# EAGLE design teensyShield1.5 (EAGLE 7.5.0)
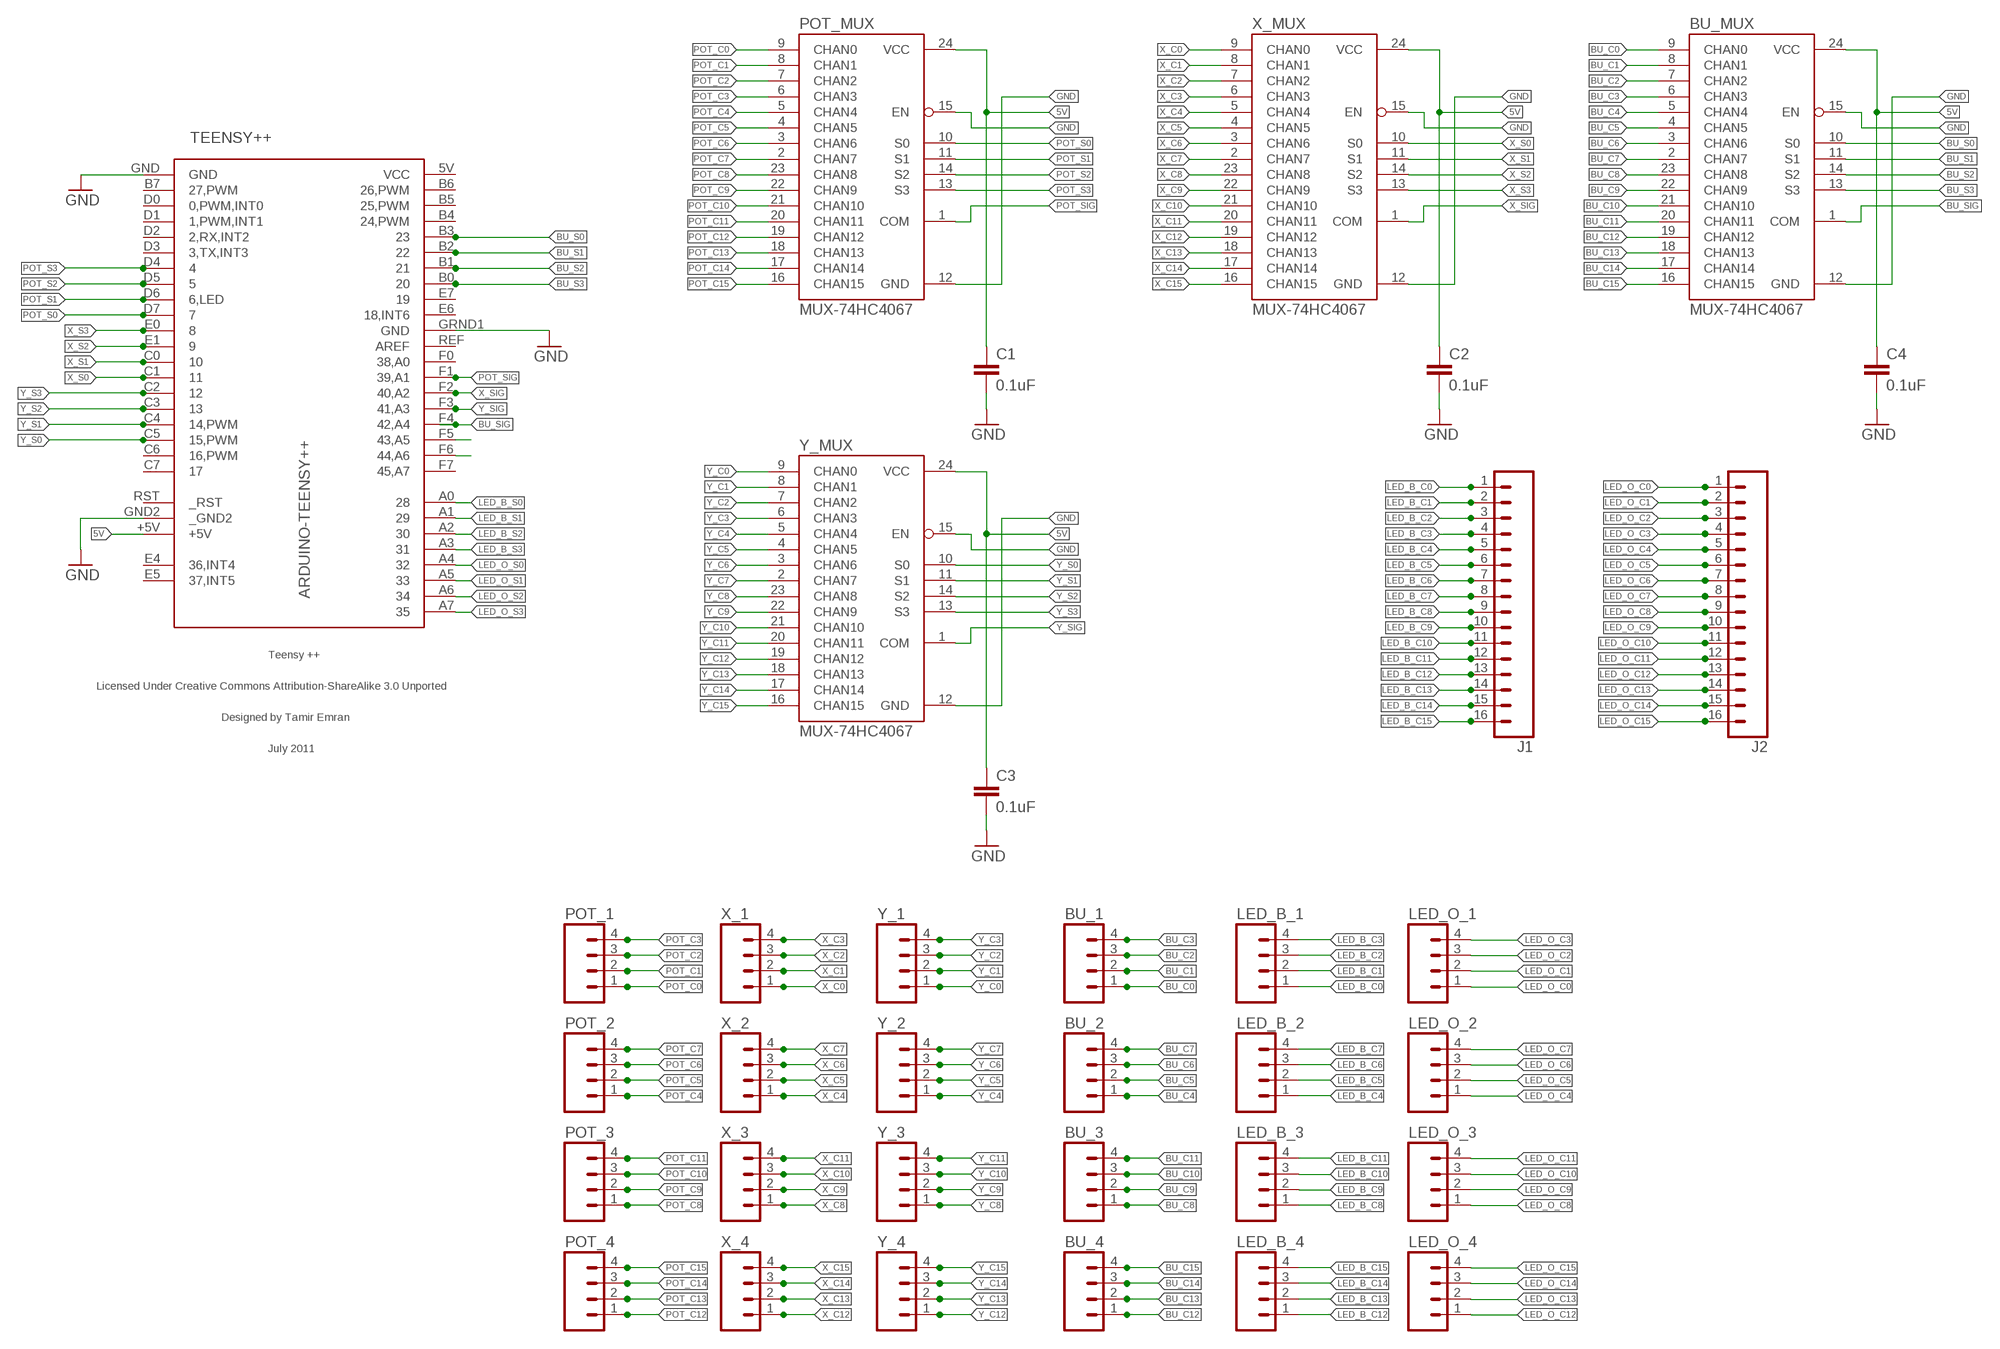
[diagram p0: schematic, sheet 1]

## Parts
BU_1  M04NO_SILK_ALL_ROUND  [1X04_NO_SILK_ALL_ROUND]
BU_2  M04NO_SILK_ALL_ROUND  [1X04_NO_SILK_ALL_ROUND]
BU_3  M04NO_SILK_ALL_ROUND  [1X04_NO_SILK_ALL_ROUND]
BU_4  M04NO_SILK_ALL_ROUND  [1X04_NO_SILK_ALL_ROUND]
BU_MUX  MUX-74HC4067  MUX-74HC4067SMD  [SSOP24]
C1  0.1uF  CAP0603  [0603]
C2  0.1uF  CAP0603  [0603]
C3  0.1uF  CAP0603  [0603]
C4  0.1uF  CAP0603  [0603]
J1  M16MACHIINE-PIN_LOCK  [1X16_MACHINE-PIN-HEADER_LOCK.004]
J2  M16MACHIINE-PIN_LOCK  [1X16_MACHINE-PIN-HEADER_LOCK.004]
LED_B_1  M04NO_SILK_ALL_ROUND  [1X04_NO_SILK_ALL_ROUND]
LED_B_2  M04NO_SILK_ALL_ROUND  [1X04_NO_SILK_ALL_ROUND]
LED_B_3  M04NO_SILK_ALL_ROUND  [1X04_NO_SILK_ALL_ROUND]
LED_B_4  M04NO_SILK_ALL_ROUND  [1X04_NO_SILK_ALL_ROUND]
LED_O_1  M04NO_SILK_ALL_ROUND  [1X04_NO_SILK_ALL_ROUND]
LED_O_2  M04NO_SILK_ALL_ROUND  [1X04_NO_SILK_ALL_ROUND]
LED_O_3  M04NO_SILK_ALL_ROUND  [1X04_NO_SILK_ALL_ROUND]
LED_O_4  M04NO_SILK_ALL_ROUND  [1X04_NO_SILK_ALL_ROUND]
POT_1  M04NO_SILK_ALL_ROUND  [1X04_NO_SILK_ALL_ROUND]
POT_2  M04NO_SILK_ALL_ROUND  [1X04_NO_SILK_ALL_ROUND]
POT_3  M04NO_SILK_ALL_ROUND  [1X04_NO_SILK_ALL_ROUND]
POT_4  M04NO_SILK_ALL_ROUND  [1X04_NO_SILK_ALL_ROUND]
POT_MUX  MUX-74HC4067  MUX-74HC4067SMD  [SSOP24]
TEENSY++  ARDUINO-TEENSY++  [TEENSY++]
X_1  M04NO_SILK_ALL_ROUND  [1X04_NO_SILK_ALL_ROUND]
X_2  M04NO_SILK_ALL_ROUND  [1X04_NO_SILK_ALL_ROUND]
X_3  M04NO_SILK_ALL_ROUND  [1X04_NO_SILK_ALL_ROUND]
X_4  M04NO_SILK_ALL_ROUND  [1X04_NO_SILK_ALL_ROUND]
X_MUX  MUX-74HC4067  MUX-74HC4067SMD  [SSOP24]
Y_1  M04NO_SILK_ALL_ROUND  [1X04_NO_SILK_ALL_ROUND]
Y_2  M04NO_SILK_ALL_ROUND  [1X04_NO_SILK_ALL_ROUND]
Y_3  M04NO_SILK_ALL_ROUND  [1X04_NO_SILK_ALL_ROUND]
Y_4  M04NO_SILK_ALL_ROUND  [1X04_NO_SILK_ALL_ROUND]
Y_MUX  MUX-74HC4067  MUX-74HC4067SMD  [SSOP24]

## Nets
5V: BU_MUX.24(VCC) C1.1 C2.1 C3.1 C4.1 POT_MUX.24(VCC) X_MUX.24(VCC) Y_MUX.24(VCC)
BU_C0: BU_1.1 BU_MUX.9(CHAN0)
BU_C1: BU_1.2 BU_MUX.8(CHAN1)
BU_C2: BU_1.3 BU_MUX.7(CHAN2)
BU_C3: BU_1.4 BU_MUX.6(CHAN3)
BU_C4: BU_2.1 BU_MUX.5(CHAN4)
BU_C5: BU_2.2 BU_MUX.4(CHAN5)
BU_C6: BU_2.3 BU_MUX.3(CHAN6)
BU_C7: BU_2.4 BU_MUX.2(CHAN7)
BU_C8: BU_3.1 BU_MUX.23(CHAN8)
BU_C9: BU_3.2 BU_MUX.22(CHAN9)
BU_C10: BU_3.3 BU_MUX.21(CHAN10)
BU_C11: BU_3.4 BU_MUX.20(CHAN11)
BU_C12: BU_4.1 BU_MUX.19(CHAN12)
BU_C13: BU_4.2 BU_MUX.18(CHAN13)
BU_C14: BU_4.3 BU_MUX.17(CHAN14)
BU_C15: BU_4.4 BU_MUX.16(CHAN15)
BU_S0: BU_MUX.10(S0) TEENSY++.B3
BU_S1: BU_MUX.11(S1) TEENSY++.B2
BU_S2: BU_MUX.14(S2) TEENSY++.B1
BU_S3: BU_MUX.13(S3) TEENSY++.B0
BU_SIG: BU_MUX.1(COM) TEENSY++.F4(42,A4)
GND: BU_MUX.12(GND) BU_MUX.15(EN) C1.2 C2.2 C3.2 C4.2 POT_MUX.12(GND) POT_MUX.15(EN) TEENSY++.GND TEENSY++.GND2(_GND2) TEENSY++.GRND1(GND) X_MUX.12(GND) X_MUX.15(EN) Y_MUX.12(GND) Y_MUX.15(EN)
LED_B_C0: J1.1 LED_B_1.1
LED_B_C1: J1.2 LED_B_1.2
LED_B_C2: J1.3 LED_B_1.3
LED_B_C3: J1.4 LED_B_1.4
LED_B_C4: J1.5 LED_B_2.1
LED_B_C5: J1.6 LED_B_2.2
LED_B_C6: J1.7 LED_B_2.3
LED_B_C7: J1.8 LED_B_2.4
LED_B_C8: J1.9 LED_B_3.1
LED_B_C9: J1.10 LED_B_3.2
LED_B_C10: J1.11 LED_B_3.3
LED_B_C11: J1.12 LED_B_3.4
LED_B_C12: J1.13 LED_B_4.1
LED_B_C13: J1.14 LED_B_4.2
LED_B_C14: J1.15 LED_B_4.3
LED_B_C15: J1.16 LED_B_4.4
LED_B_S0: TEENSY++.A0
LED_B_S1: TEENSY++.A1
LED_B_S2: TEENSY++.A2
LED_B_S3: TEENSY++.A3
LED_O_C0: J2.1 LED_O_1.1
LED_O_C1: J2.2 LED_O_1.2
LED_O_C2: J2.3 LED_O_1.3
LED_O_C3: J2.4 LED_O_1.4
LED_O_C4: J2.5 LED_O_2.1
LED_O_C5: J2.6 LED_O_2.2
LED_O_C6: J2.7 LED_O_2.3
LED_O_C7: J2.8 LED_O_2.4
LED_O_C8: J2.9 LED_O_3.1
LED_O_C9: J2.10 LED_O_3.2
LED_O_C10: J2.11 LED_O_3.3
LED_O_C11: J2.12 LED_O_3.4
LED_O_C12: J2.13 LED_O_4.1
LED_O_C13: J2.14 LED_O_4.2
LED_O_C14: J2.15 LED_O_4.3
LED_O_C15: J2.16 LED_O_4.4
LED_O_S0: TEENSY++.A4
LED_O_S1: TEENSY++.A5
LED_O_S2: TEENSY++.A6
LED_O_S3: TEENSY++.A7
N$1: TEENSY++.F2(40,A2)
N$2: TEENSY++.F1(39,A1)
N$3: TEENSY++.F5(43,A5)
N$4: TEENSY++.+5V
N$5: TEENSY++.F6(44,A6)
POT_C0: POT_1.1 POT_MUX.9(CHAN0)
POT_C1: POT_1.2 POT_MUX.8(CHAN1)
POT_C2: POT_1.3 POT_MUX.7(CHAN2)
POT_C3: POT_1.4 POT_MUX.6(CHAN3)
POT_C4: POT_2.1 POT_MUX.5(CHAN4)
POT_C5: POT_2.2 POT_MUX.4(CHAN5)
POT_C6: POT_2.3 POT_MUX.3(CHAN6)
POT_C7: POT_2.4 POT_MUX.2(CHAN7)
POT_C8: POT_3.1 POT_MUX.23(CHAN8)
POT_C9: POT_3.2 POT_MUX.22(CHAN9)
POT_C10: POT_3.3 POT_MUX.21(CHAN10)
POT_C11: POT_3.4 POT_MUX.20(CHAN11)
POT_C12: POT_4.1 POT_MUX.19(CHAN12)
POT_C13: POT_4.2 POT_MUX.18(CHAN13)
POT_C14: POT_4.3 POT_MUX.17(CHAN14)
POT_C15: POT_4.4 POT_MUX.16(CHAN15)
POT_S0: POT_MUX.10(S0) TEENSY++.D7
POT_S1: POT_MUX.11(S1) TEENSY++.D6(6,LED)
POT_S2: POT_MUX.14(S2) TEENSY++.D5
POT_S3: POT_MUX.13(S3) TEENSY++.D4
POT_SIG: POT_MUX.1(COM)
X_C0: X_1.1 X_MUX.9(CHAN0)
X_C1: X_1.2 X_MUX.8(CHAN1)
X_C2: X_1.3 X_MUX.7(CHAN2)
X_C3: X_1.4 X_MUX.6(CHAN3)
X_C4: X_2.1 X_MUX.5(CHAN4)
X_C5: X_2.2 X_MUX.4(CHAN5)
X_C6: X_2.3 X_MUX.3(CHAN6)
X_C7: X_2.4 X_MUX.2(CHAN7)
X_C8: X_3.1 X_MUX.23(CHAN8)
X_C9: X_3.2 X_MUX.22(CHAN9)
X_C10: X_3.3 X_MUX.21(CHAN10)
X_C11: X_3.4 X_MUX.20(CHAN11)
X_C12: X_4.1 X_MUX.19(CHAN12)
X_C13: X_4.2 X_MUX.18(CHAN13)
X_C14: X_4.3 X_MUX.17(CHAN14)
X_C15: X_4.4 X_MUX.16(CHAN15)
X_S0: TEENSY++.C1 X_MUX.10(S0)
X_S1: TEENSY++.C0 X_MUX.11(S1)
X_S2: TEENSY++.E1 X_MUX.14(S2)
X_S3: TEENSY++.E0 X_MUX.13(S3)
X_SIG: X_MUX.1(COM)
Y_C0: Y_1.1 Y_MUX.9(CHAN0)
Y_C1: Y_1.2 Y_MUX.8(CHAN1)
Y_C2: Y_1.3 Y_MUX.7(CHAN2)
Y_C3: Y_1.4 Y_MUX.6(CHAN3)
Y_C4: Y_2.1 Y_MUX.5(CHAN4)
Y_C5: Y_2.2 Y_MUX.4(CHAN5)
Y_C6: Y_2.3 Y_MUX.3(CHAN6)
Y_C7: Y_2.4 Y_MUX.2(CHAN7)
Y_C8: Y_3.1 Y_MUX.23(CHAN8)
Y_C9: Y_3.2 Y_MUX.22(CHAN9)
Y_C10: Y_3.3 Y_MUX.21(CHAN10)
Y_C11: Y_3.4 Y_MUX.20(CHAN11)
Y_C12: Y_4.1 Y_MUX.19(CHAN12)
Y_C13: Y_4.2 Y_MUX.18(CHAN13)
Y_C14: Y_4.3 Y_MUX.17(CHAN14)
Y_C15: Y_4.4 Y_MUX.16(CHAN15)
Y_S0: TEENSY++.C5(15,PWM) Y_MUX.10(S0)
Y_S1: TEENSY++.C4(14,PWM) Y_MUX.11(S1)
Y_S2: TEENSY++.C3 Y_MUX.14(S2)
Y_S3: TEENSY++.C2 Y_MUX.13(S3)
Y_SIG: TEENSY++.F3(41,A3) Y_MUX.1(COM)
Unconnected: TEENSY++.B4(24,PWM) TEENSY++.B5(25,PWM) TEENSY++.B6(26,PWM) TEENSY++.B7(27,PWM) TEENSY++.C6(16,PWM) TEENSY++.C7 TEENSY++.D0(0,PWM,INT0) TEENSY++.D1(1,PWM,INT1) TEENSY++.D2(2,RX,INT2) TEENSY++.D3(3,TX,INT3) TEENSY++.E4(36,INT4) TEENSY++.E5(37,INT5) TEENSY++.E6(18,INT6) TEENSY++.E7 TEENSY++.F0(38,A0) TEENSY++.F7(45,A7) TEENSY++.REF(AREF) TEENSY++.RST(_RST)

## Power pins joined to a net without a drawn wire
VCC: TEENSY++.5V(VCC)

## Library data of the parts
BU_1-BU_4 LED_B_1-LED_B_4 LED_O_1-LED_O_4 POT_1-POT_4 X_1-X_4 Y_1-Y_4 = SparkFun-Connectors:M04: Header 4 Standard 4-pin 0.1" header. Use with straight break away headers (SKU : PRT-00116), right angle break away headers (PRT-00553), swiss pins (PRT-00743), machine pins (PRT-00117), and female headers (PRT-00115). Molex polarized connector foot print use with SKU : PRT-08231 with associated crimp pins and housings. 1MM SMD Version SKU: PRT-10208; PROD_ID: CONN-09696
BU_MUX POT_MUX X_MUX Y_MUX = SparkFun:MUX-74HC4067
C1-C4 = SparkFun:CAP: Capacitor Standard 0603 ceramic capacitor, and 0.1" leaded capacitor.
J1 J2 = SparkFun-Connectors:M16: 1x16 .1" header
TEENSY++ = teensypp:ARDUINO-TEENSY++: Teensy ++ Original Design by Mark Gross Modified Design by Tamir Emran Licensed Under Creative Commons Attribution-ShareAlike 3.0 Unported (CC BY-SA 3.0)

## Board
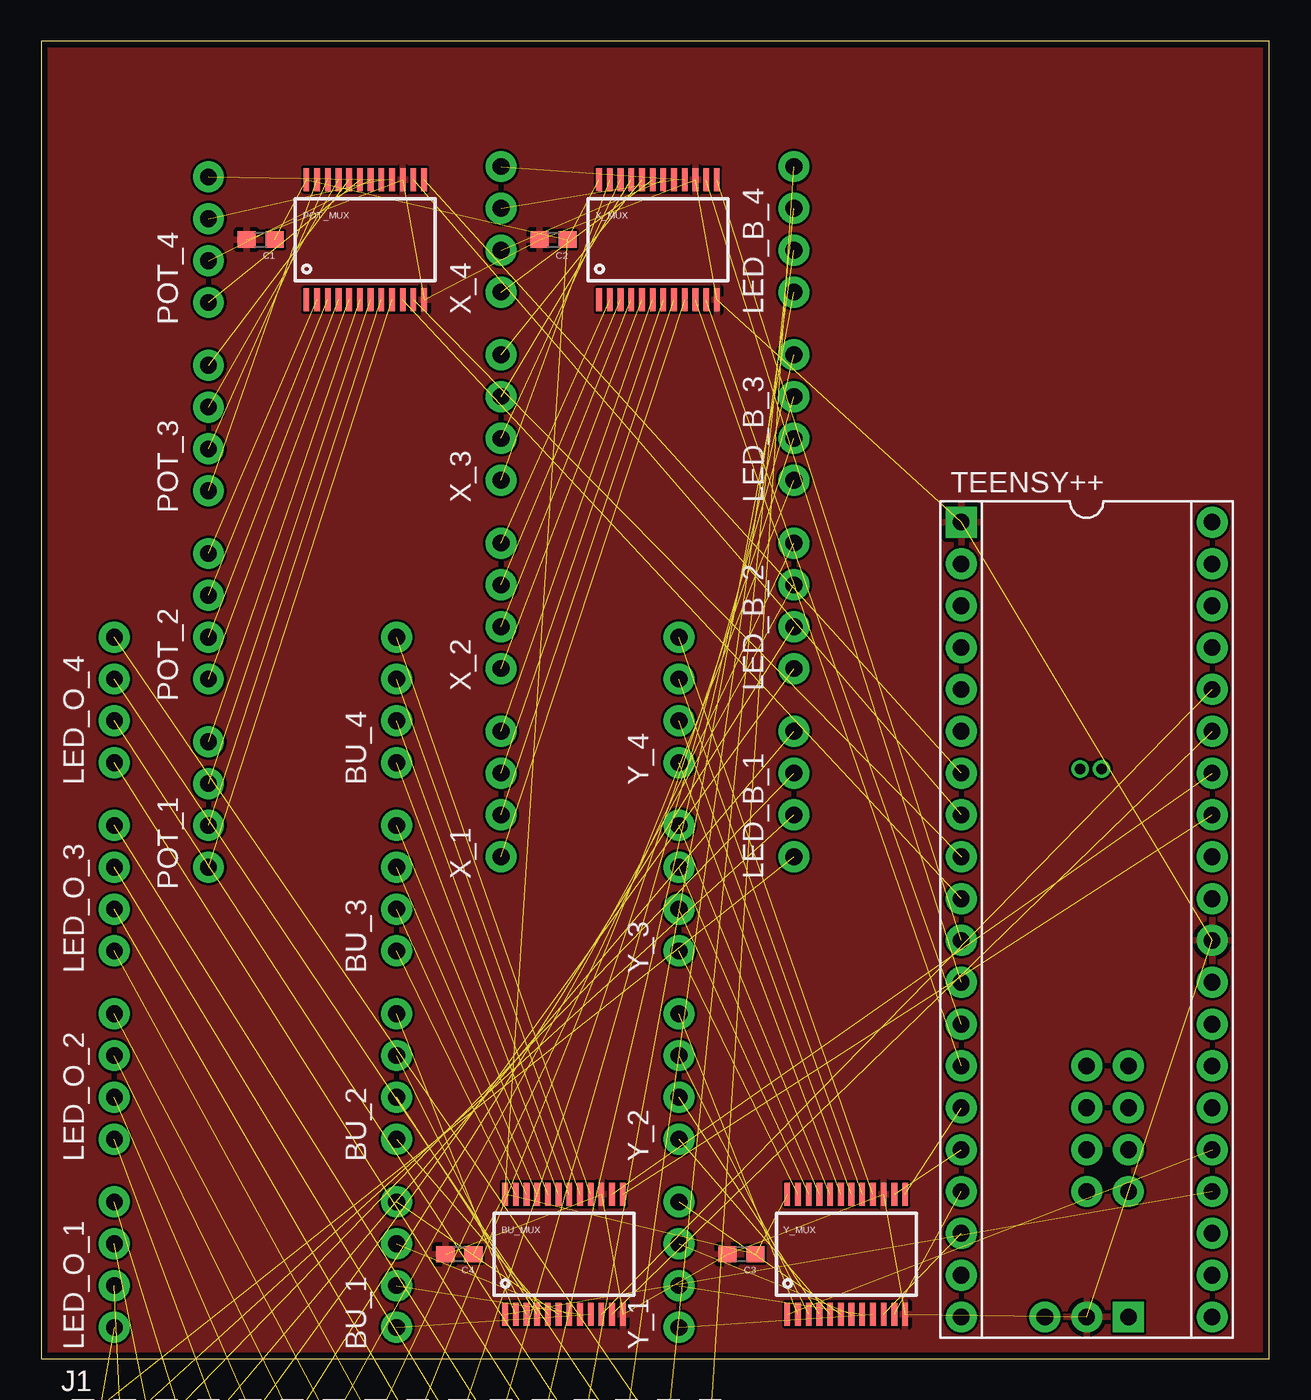
[diagram p1: board, top side]
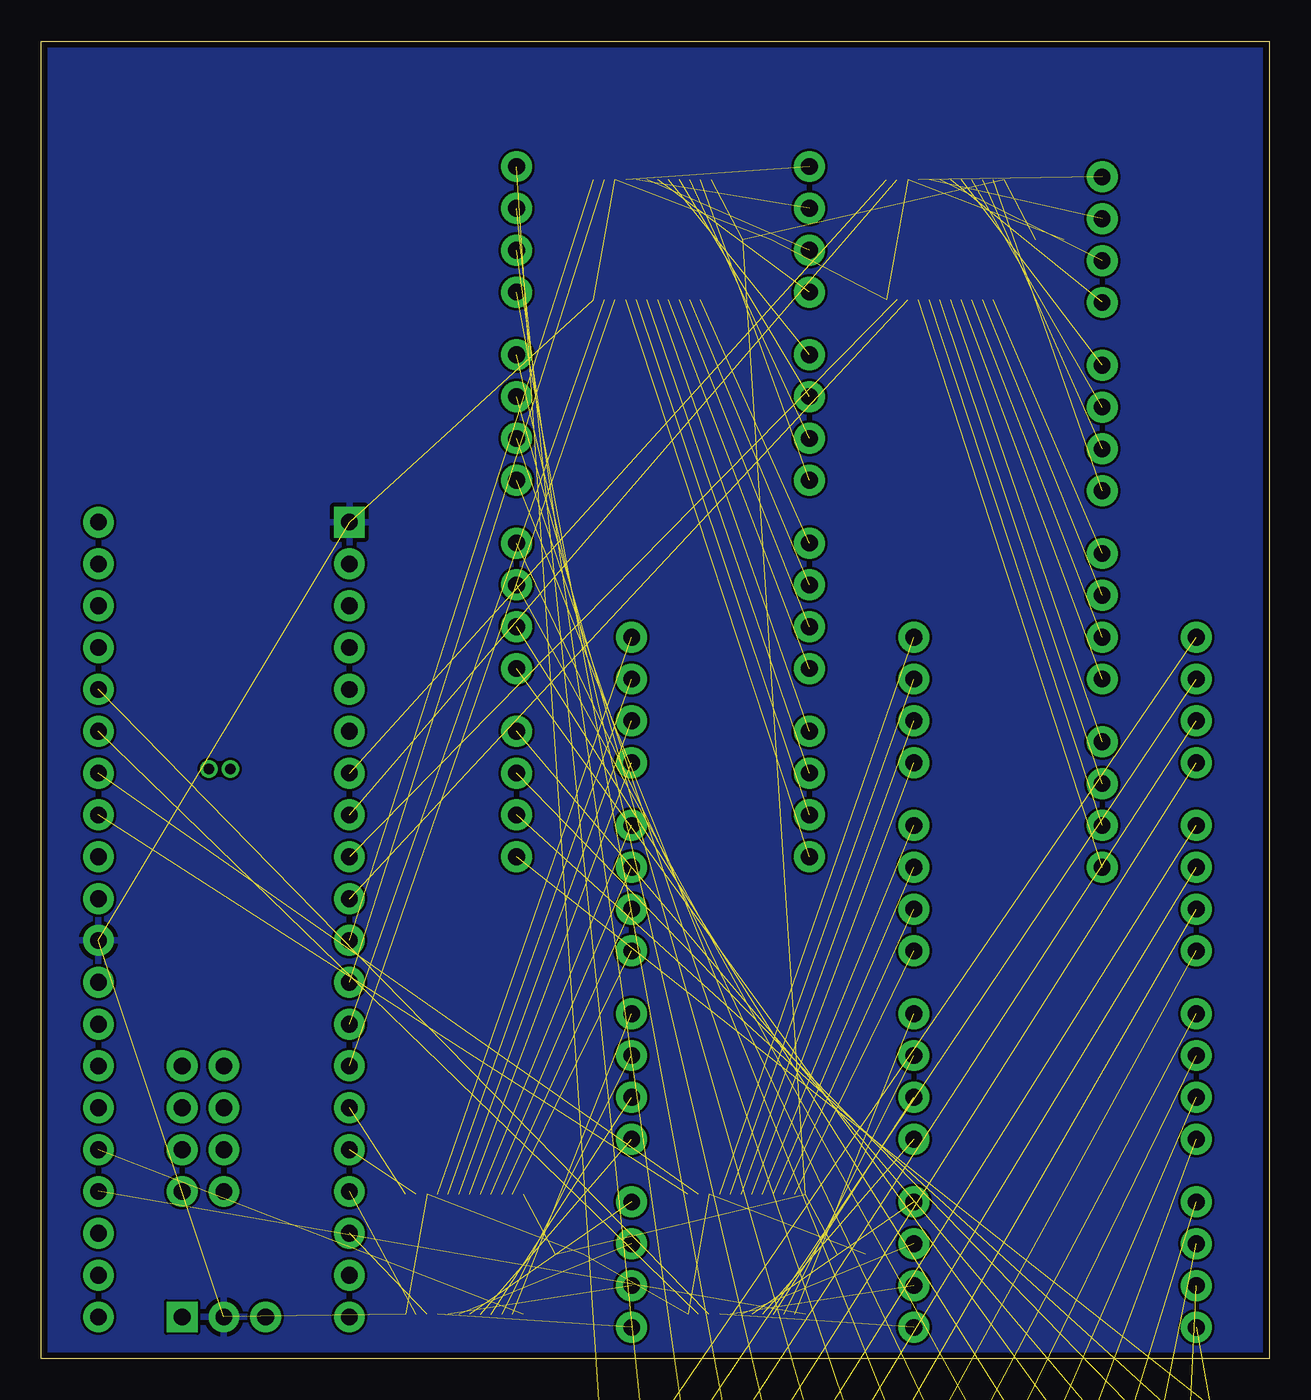
[diagram p2: board, bottom side, seen from below]

Size 74.6 x 80 mm. Coordinates in mm from the lower left corner, seen from the top.
Outline: 0,0 74.6,0 74.6,80 0,80 0,0
Copper layers (1*16): Top 0.0356mm / dielectric 1.5011mm / Bottom 0.0356mm
Design rules "oshpark-2layer": minimum track width 6mil, minimum drill 13mil, track to track 6mil, track to pad 6mil, pad to pad 6mil, via to via 6mil, smd to smd 6mil, copper to edge 15mil, drill to drill 6mil, minimum pad ring 7mil, minimum via ring 7mil, stop-mask expansion 2.5mil, vias tented up to drill 0mil, thermal gap 10mil

### Footprints (pad centres in the part's own frame; a part is rotated, then mirrored left to right if it is on the bottom)
1X04_NO_SILK_ALL_ROUND = drill 1.016 pad 1.88: 1 0,0; 2 2.54,0; 3 5.08,0; 4 7.62,0
SSOP24 = smd 0.348 x 1.397: 1 -3.575,-3.656; 2 -2.925,-3.656; 3 -2.275,-3.656; 4 -1.625,-3.656; 5 -0.975,-3.656; 6 -0.325,-3.656; 7 0.325,-3.656; 8 0.975,-3.656; 9 1.625,-3.656; 10 2.275,-3.656; 11 2.925,-3.656; 12 3.575,-3.656; 13 3.575,3.656; 14 2.925,3.656; 15 2.275,3.656; 16 1.625,3.656; 17 0.975,3.656; 18 0.325,3.656; 19 -0.325,3.656; 20 -0.975,3.656; 21 -1.625,3.656; 22 -2.275,3.656; 23 -2.925,3.656; 24 -3.575,3.656
0603 = smd 1.1 x 1: 1 -0.85,0; 2 0.85,0
1X16_MACHINE-PIN-HEADER_LOCK.004 = drill 0.889: 1 0,0.102; 2 2.54,-0.102; 3 5.08,0.102; 4 7.62,-0.102; 5 10.16,0.102; 6 12.7,-0.102; 7 15.24,0.102; 8 17.78,-0.102; 9 20.32,0.102; 10 22.86,-0.102; 11 25.4,0.102; 12 27.94,-0.102; 13 30.48,0.102; 14 33.02,-0.102; 15 35.56,0.102; 16 38.1,-0.102
TEENSY++ = drill 1.016 pad 1.88: 5V 24.13,-2.54; +5V -24.13,7.62; A0 8.89,0; A1 11.43,0; A2 13.97,0; A3 16.51,0; A4 8.89,2.54; A5 11.43,2.54; A6 13.97,2.54; A7 16.51,2.54; B0 -6.35,7.62; B1 -8.89,7.62; B2 -11.43,7.62; B3 -13.97,7.62; B4 -16.51,7.62; B5 -19.05,7.62; B6 -21.59,7.62; B7 -21.59,-7.62; C0 6.35,-7.62; C1 8.89,-7.62; C2 11.43,-7.62; C3 13.97,-7.62; C4 16.51,-7.62; C5 19.05,-7.62; C6 21.59,-7.62; C7 24.13,-7.62; D0 -19.05,-7.62; D1 -16.51,-7.62; D2 -13.97,-7.62; D3 -11.43,-7.62; D4 -8.89,-7.62; D5 -6.35,-7.62; D6 -3.81,-7.62; D7 -1.27,-7.62; E0 1.27,-7.62; E1 3.81,-7.62; E6 -1.27,7.62; E7 -3.81,7.62; F0 6.35,7.62; F1 8.89,7.62; F2 11.43,7.62; F3 13.97,7.62; F4 16.51,7.62; F5 19.05,7.62; F6 21.59,7.62; F7 24.13,7.62; GND2 24.13,0; GRND1 1.27,7.62; REF 3.81,7.62 | drill 0.635 pad 1.067: E4 -9.144,0.914; E5 -9.144,-0.406 | drill 1.016 pad 1.88 square: GND -24.13,-7.62; RST 24.13,2.54

### Placement (x,y rotation side)
BU_1  21.59,1.91 90 top
BU_2  21.59,13.34 90 top
BU_3  21.59,24.77 90 top
BU_4  21.59,36.2 90 top
BU_MUX  31.75,6.35 0 top
C1  13.34,67.94 180 top
C2  31.11,67.94 180 top
C3  42.55,6.35 180 top
C4  25.4,6.35 180 top
J1  2.54,-3.81 0 top  (outside the outline)
J2  2.54,-8.89 0 top  (outside the outline)
LED_B_1  45.72,30.48 90 top
LED_B_2  45.72,41.91 90 top
LED_B_3  45.72,53.34 90 top
LED_B_4  45.72,64.77 90 top
LED_O_1  4.45,1.91 90 top
LED_O_2  4.45,13.34 90 top
LED_O_3  4.45,24.77 90 top
LED_O_4  4.45,36.2 90 top
POT_1  10.16,29.84 90 top
POT_2  10.16,41.27 90 top
POT_3  10.16,52.7 90 top
POT_4  10.16,64.14 90 top
POT_MUX  19.68,67.94 0 top
TEENSY++  63.5,26.67 270 top
X_1  27.94,30.48 90 top
X_2  27.94,41.91 90 top
X_3  27.94,53.34 90 top
X_4  27.94,64.77 90 top
X_MUX  37.47,67.94 0 top
Y_1  38.73,1.91 90 top
Y_2  38.73,13.34 90 top
Y_3  38.73,24.77 90 top
Y_4  38.73,36.2 90 top
Y_MUX  48.9,6.35 0 top

### Tracks (layer width: path | path; a pad name or v marks a point on that pad's centre or on a via)
5V  (7 unrouted)
BU_C0  (1 unrouted)
BU_C1  (1 unrouted)
BU_C2  (1 unrouted)
BU_C3  (1 unrouted)
BU_C4  (1 unrouted)
BU_C5  (1 unrouted)
BU_C6  (1 unrouted)
BU_C7  (1 unrouted)
BU_C8  (1 unrouted)
BU_C9  (1 unrouted)
BU_C10  (1 unrouted)
BU_C11  (1 unrouted)
BU_C12  (1 unrouted)
BU_C13  (1 unrouted)
BU_C14  (1 unrouted)
BU_C15  (1 unrouted)
BU_S0  (1 unrouted)
BU_S1  (1 unrouted)
BU_S2  (1 unrouted)
BU_S3  (1 unrouted)
BU_SIG  (1 unrouted)
GND  (14 unrouted)
  pour Top: 0,0 74.93,0 74.93,80.01 0,80.01
  pour Bottom: 0,0 74.93,0 74.93,80.01 0,80.01
LED_B_C0  (1 unrouted)
LED_B_C1  (1 unrouted)
LED_B_C2  (1 unrouted)
LED_B_C3  (1 unrouted)
LED_B_C4  (1 unrouted)
LED_B_C5  (1 unrouted)
LED_B_C6  (1 unrouted)
LED_B_C7  (1 unrouted)
LED_B_C8  (1 unrouted)
LED_B_C9  (1 unrouted)
LED_B_C10  (1 unrouted)
LED_B_C11  (1 unrouted)
LED_B_C12  (1 unrouted)
LED_B_C13  (1 unrouted)
LED_B_C14  (1 unrouted)
LED_B_C15  (1 unrouted)
LED_O_C0  (1 unrouted)
LED_O_C1  (1 unrouted)
LED_O_C2  (1 unrouted)
LED_O_C3  (1 unrouted)
LED_O_C4  (1 unrouted)
LED_O_C5  (1 unrouted)
LED_O_C6  (1 unrouted)
LED_O_C7  (1 unrouted)
LED_O_C8  (1 unrouted)
LED_O_C9  (1 unrouted)
LED_O_C10  (1 unrouted)
LED_O_C11  (1 unrouted)
LED_O_C12  (1 unrouted)
LED_O_C13  (1 unrouted)
LED_O_C14  (1 unrouted)
LED_O_C15  (1 unrouted)
POT_C0  (1 unrouted)
POT_C1  (1 unrouted)
POT_C2  (1 unrouted)
POT_C3  (1 unrouted)
POT_C4  (1 unrouted)
POT_C5  (1 unrouted)
POT_C6  (1 unrouted)
POT_C7  (1 unrouted)
POT_C8  (1 unrouted)
POT_C9  (1 unrouted)
POT_C10  (1 unrouted)
POT_C11  (1 unrouted)
POT_C12  (1 unrouted)
POT_C13  (1 unrouted)
POT_C14  (1 unrouted)
POT_C15  (1 unrouted)
POT_S0  (1 unrouted)
POT_S1  (1 unrouted)
POT_S2  (1 unrouted)
POT_S3  (1 unrouted)
X_C0  (1 unrouted)
X_C1  (1 unrouted)
X_C2  (1 unrouted)
X_C3  (1 unrouted)
X_C4  (1 unrouted)
X_C5  (1 unrouted)
X_C6  (1 unrouted)
X_C7  (1 unrouted)
X_C8  (1 unrouted)
X_C9  (1 unrouted)
X_C10  (1 unrouted)
X_C11  (1 unrouted)
X_C12  (1 unrouted)
X_C13  (1 unrouted)
X_C14  (1 unrouted)
X_C15  (1 unrouted)
X_S0  (1 unrouted)
X_S1  (1 unrouted)
X_S2  (1 unrouted)
X_S3  (1 unrouted)
Y_C0  (1 unrouted)
Y_C1  (1 unrouted)
Y_C2  (1 unrouted)
Y_C3  (1 unrouted)
Y_C4  (1 unrouted)
Y_C5  (1 unrouted)
Y_C6  (1 unrouted)
Y_C7  (1 unrouted)
Y_C8  (1 unrouted)
Y_C9  (1 unrouted)
Y_C10  (1 unrouted)
Y_C11  (1 unrouted)
Y_C12  (1 unrouted)
Y_C13  (1 unrouted)
Y_C14  (1 unrouted)
Y_C15  (1 unrouted)
Y_S0  (1 unrouted)
Y_S1  (1 unrouted)
Y_S2  (1 unrouted)
Y_S3  (1 unrouted)
Y_SIG  (1 unrouted)